# Altium project braking_io.PrjPcb (part 5 of 5)

## Sheet mcu.SchDoc: Microcontroller
size A4; Organization: Badgerloop Electrical; Address1: 133 Engineering Research Building; Address2: 1500 Engineering Drive; Address3: Madison, Wi 53706
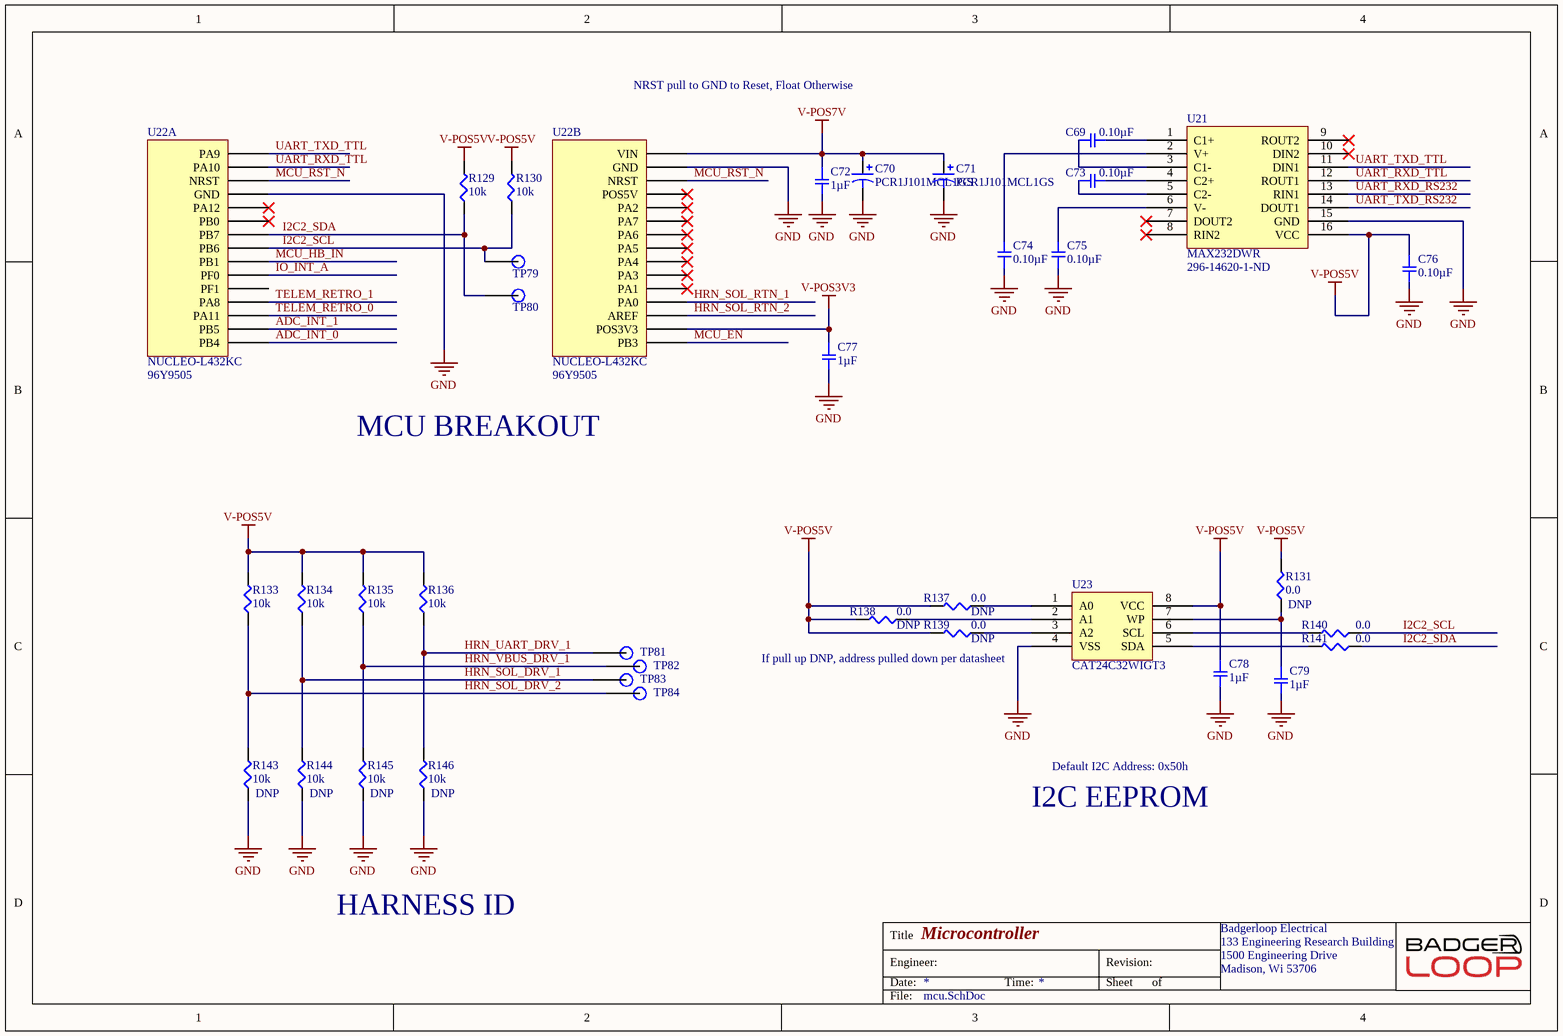
[diagram p12: mcu.SchDoc]

### Parts
C69  0.10µF  [SMD-0805C]
C70  PCR1J101MCL1GS  [CAPAE110103X126M]
C71  PCR1J101MCL1GS  [CAPAE110103X126M]
C72  1µF  [SMD-0805C]
C73  0.10µF  [SMD-0805C]
C74  0.10µF  [SMD-0805C]
C75  0.10µF  [SMD-0805C]
C76  0.10µF  [SMD-0805C]
C77  1µF  [SMD-0805C]
C78  1µF  [SMD-0805C]
C79  1µF  [SMD-0805C]
R129  10k  [SMD-0805-RES]
R130  10k  [SMD-0805-RES]
R131  0.0  [SMD-0805-RES]
R133  10k  [SMD-0805-RES]
R134  10k  [SMD-0805-RES]
R135  10k  [SMD-0805-RES]
R136  10k  [SMD-0805-RES]
R137  0.0  [SMD-0805-RES]
R138  0.0  [SMD-0805-RES]
R139  0.0  [SMD-0805-RES]
R140  0.0  [SMD-0805-RES]
R141  0.0  [SMD-0805-RES]
R143  10k  [SMD-0805-RES]
R144  10k  [SMD-0805-RES]
R145  10k  [SMD-0805-RES]
R146  10k  [SMD-0805-RES]
TP79  TP  [Test Point]  (value not drawn)
TP80  TP  [Test Point]  (value not drawn)
TP81  TP  [Test Point]  (value not drawn)
TP82  TP  [Test Point]  (value not drawn)
TP83  TP  [Test Point]  (value not drawn)
TP84  TP  [Test Point]  (value not drawn)
U21  MAX232DWR  Supplier Part Number 1: 296-14620-1-ND  [SOP127P1060X175-16N]
U22  NUCLEO-L432KC  Supplier Part Number 2: 96Y9505  [NUCLEO-L432KC]  (parts A,B of 2)
U23  CAT24C32WIGT3  [SOP127P600X175-8N]

### Nets
GND: C70.2 C71.2 C72.2 C74.1 C75.1 C76.2 C77.2 C78.2 C79.2 R143.1 R144.1 R145.1 R146.1 U21.15(GND) U22.3.4(GND) U22.4.2(GND) U23.4(VSS)
V-POS3V3: C77.1 U22.4.14(POS3V3)
V-POS5V: C76.1 C78.1 R129.2 R130.2 R131.2 R133.2 R134.2 R135.2 R136.2 R137.2 R138.2 R139.2 U21.16(VCC) U23.8(VCC)
V-POS7V: C70.1 C71.1 C72.1 U22.4.1(VIN)
ADC_INT_0: U22.3.15(PB4)
ADC_INT_1: U22.3.14(PB5)
HRN_SOL_DRV_1: R134.1 R144.2 TP83.1
HRN_SOL_DRV_2: R133.1 R143.2 TP84.1
HRN_SOL_RTN_1: U22.4.12(PA0)
HRN_SOL_RTN_2: U22.4.13(AREF)
HRN_UART_DRV_1: R136.1 R146.2 TP81.1
HRN_VBUS_DRV_1: R135.1 R145.2 TP82.1
I2C2_SCL: R130.1 R140.1 TP79.1 U22.3.8(PB6)
I2C2_SDA: R129.1 R141.1 TP80.1 U22.3.7(PB7)
IO_INT_A: U22.3.10(PF0)
MCU_EN: U22.4.15(PB3)
MCU_HB_IN: U22.3.9(PB1)
MCU_RST_N: U22.3.3(NRST) U22.4.3(NRST)
TELEM_RETRO_0: U22.3.13(PA11)
TELEM_RETRO_1: U22.3.12(PA8)
UART_RXD_RS232: U21.13(RIN1)
UART_RXD_TTL: U21.12(ROUT1) U22.3.2(PA10)
UART_TXD_RS232: U21.14(DOUT1)
UART_TXD_TTL: U21.11(DIN1) U22.3.1(PA9)
NetC69_1: C69.1 U21.3(C1-)
NetC69_2: C69.2 U21.1(C1+)
NetC73_1: C73.1 U21.5(C2-)
NetC73_2: C73.2 U21.4(C2+)
NetC74_2: C74.2 U21.2(V+)
NetC75_2: C75.2 U21.6(V-)
NetC79_1: C79.1 R131.1 U23.7(WP)
NetR137_1: R137.1 U23.1(A0)
NetR138_1: R138.1 U23.2(A1)
NetR139_1: R139.1 U23.3(A2)
NetR140_2: R140.2 U23.6(SCL)
NetR141_2: R141.2 U23.5(SDA)

Not connected (* = marked no-connect by the designer): U21 7(DOUT2)* 8(RIN2)* 9(ROUT2)* 10(DIN2)*; U22 3.5(PA12)* 3.6(PB0)* 3.11(PF1) 4.4(POS5V)* 4.5(PA2)* 4.6(PA7)* 4.7(PA6)* 4.8(PA5)* 4.9(PA4)* 4.10(PA3)* 4.11(PA1)*

### Notes on the sheet
- NRST pull to GND to Reset, Float Otherwise
- MCU BREAKOUT
- If pull up DNP, address pulled down per datasheet
- Default I2C Address: 0x50h
- I2C EEPROM
- HARNESS ID
- Title
- Engineer:
- Date:
- Time:
- Revision:
- Sheet
- of
- File:

### Library data of the parts
C69 C73-C75 = GRM219R71C104JA01D: CAP CER 0.1UF 16V X7R 0805; Manufacturer: Murata Electronics North America; Factory Stock: 0; Unit Price (USD): 0.12; Minimum Quantity: 1; Tolerance: ±5%; Datasheets: -; Image: //media.digikey.com/Renders/Murata%20Renders/0805%20(2012%20Metric)%20.85mm.jpg; Digi-Key Part Number: 490-12557-1-ND; Part Number: GRM219R71C104JA01D; Quantity Available: 6635; @ qty: 0; Packaging: Cut Tape (CT); Series: GRM; Part Status: Active; Value: 0.10µF; Voltage: 16V; Temperature Coefficient: X7R; Operating Temperature: -55°C ~ 125°C; Features: -; Ratings: -; Applications: General Purpose; Mounting Type: Surface Mount, MLCC; Package / Case: 0805 (2012 Metric); Size / Dimension: 0.079" L x 0.049" W (2.00mm x 1.25mm); Height - Seated (Max): -; Thickness (Max): 0.037" (0.95mm); Lead Spacing: -; Lead Style: -
C70 C71 = PCR1J101MCL1GS: CAP ALUM POLY 100UF 20% 63V SMD; Manufacturer: Nichicon; ESR (Equivalent Series Resistance): 24mR; Ripple Current: 3A; Leakage Current: 3uA; Life (Hours): 4000Hour; Dissipation Factor: 0.08%; Supplier 1: Digi-Key; Manufacturer Part Number: PCR1J101MCL1GS; Stock 1: 11476; Pricing 1: 1=3.63000, 10=2.92800, 100=2.28380 (USD); RoHS: Yes; Mount: Surface Mount,PCB; Case/Package: Radial; Weight: 0.045856oz; Min Operating Temperature: -55°C; Max Operating Temperature: 125°C; Capacitance: 100uF; Tolerance: 20%; Voltage Rating (DC): 63V; Package Quantity: 1; Packaging: Tape and Reel; Voltage Rating: 63V; Termination: SMD/SMT; Voltage: 63V; Diameter: 10mm; Length: 12.7mm; Height: 12.7mm; Height - Seated (Max): 0.504inch; Depth: 10.3mm; Lead Pitch: 4.6mm; Lead Free: Lead Free; ComponentLink1URL: https://datasheet.ciiva.com/29551/e-ch-ta-29551389.pdf?src-supplier=Digi-Key; ComponentLink1Description: https://datasheet.ciiva.com/29551/e-ch-ta-29551389.pdf?src-supplier=Digi-Key; ComponentLink2URL: https://datasheet.ciiva.com/29551/e-ch-ta-29551390.pdf?src-supplier=Digi-Key; ComponentLink2Description: https://datasheet.ciiva.com/29551/e-ch-ta-29551390.pdf?src-supplier=Digi-Key; ComponentLink3URL: https://datasheet.ciiva.com/29551/e-ch-ta-29551391.pdf?src-supplier=Digi-Key; ComponentLink3Description: https://datasheet.ciiva.com/29551/e-ch-ta-29551391.pdf?src-supplier=Digi-Key; Supplier Part Number 1: 493-13783-1-ND
C72 C77-C79 = GRM21BR71H105KA12L: CAP CER 1UF 50V X7R 0805; Manufacturer: Murata Electronics North America; Factory Stock: 0; Unit Price (USD): 0.25; Minimum Quantity: 1; Tolerance: ±10%; Datasheets: http://www.murata.com/~/media/webrenewal/support/library/catalog/products/capacitor/mlcc/c02e.pdf; Image: //media.digikey.com/Renders/Murata%20Renders/0805%20(2012%20Metric)%20.85mm.jpg; Digi-Key Part Number: 490-4736-1-ND; Part Number: GRM21BR71H105KA12L; Quantity Available: 988032; @ qty: 0; Packaging: Cut Tape (CT); Series: GRM; Part Status: Active; Value: 1µF; Voltage: 50V; Temperature Coefficient: X7R; Operating Temperature: -55°C ~ 125°C; Features: -; Ratings: -; Applications: General Purpose; Mounting Type: Surface Mount, MLCC; Package / Case: 0805 (2012 Metric); Size / Dimension: 0.079" L x 0.049" W (2.00mm x 1.25mm); Height - Seated (Max): -; Thickness (Max): 0.053" (1.35mm); Lead Spacing: -; Lead Style: -
C76 = GRM219R71E104KA01D: CAP CER 0.1UF 25V X7R 0805; Manufacturer: Murata Electronics North America; Factory Stock: 0; Unit Price (USD): 0.12; Minimum Quantity: 1; Tolerance: ±10%; Datasheets: http://www.murata.com/~/media/webrenewal/support/library/catalog/products/capacitor/mlcc/c02e.pdf; Image: //media.digikey.com/Renders/Murata%20Renders/0805%20(2012%20Metric)%20.85mm.jpg; Digi-Key Part Number: 490-12754-1-ND; Part Number: GRM219R71E104KA01D; Quantity Available: 8594; @ qty: 0; Packaging: Cut Tape (CT); Series: GRM; Part Status: Active; Value: 0.10µF; Voltage: 25V; Temperature Coefficient: X7R; Operating Temperature: -55°C ~ 125°C; Features: -; Ratings: -; Applications: General Purpose; Mounting Type: Surface Mount, MLCC; Package / Case: 0805 (2012 Metric); Size / Dimension: 0.079" L x 0.049" W (2.00mm x 1.25mm); Height - Seated (Max): -; Thickness (Max): 0.037" (0.95mm); Lead Spacing: -; Lead Style: -
R129 R130 R133-R136 R143-R146 = ERJ-P06J103V: RES SMD 10K OHM 5% 1/2W 0805; Manufacturer: Panasonic Electronic Components; Factory Stock: 0; Unit Price (USD): 0.01839; @ qty: 1500; Minimum Quantity: 1; Power (Watts): 0.5W, 1/2W; Temperature Coefficient: ±200ppm/°C; Part Number: ERJ-P06J103V; Datasheets: https://industrial.panasonic.com/cdbs/www-data/pdf/RDA0000/AOA0000C243.pdf; Image: //media.digikey.com/Renders/Panasonic%20Renders/ERJ-0805%20Pkg.jpg; Digi-Key Part Number: P10KADCT-ND; Quantity Available: 413576; Packaging: Cut Tape (CT); Series: ERJ; Part Status: Active; Value: 10k; Tolerance: ±5%; Composition: Thick Film; Features: Automotive AEC-Q200, Pulse Withstanding; Operating Temperature: -55°C ~ 155°C; Package / Case: 0805 (2012 Metric); Supplier Device Package: 0805; Size / Dimension: 0.079" L x 0.049" W (2.00mm x 1.25mm); Height - Seated (Max): 0.028" (0.70mm); Number of Terminations: 2; Failure Rate: -
  R143-R146: DNP: DNP
R131 R137-R141 = ERJ-6GEY0R00V: RES SMD 0.0 OHM JUMPER 1/8W 0805; Manufacturer: Panasonic Electronic Components; Factory Stock: 0; Unit Price (USD): 0.00544; @ qty: 1500; Minimum Quantity: 1; Power (Watts): 0.125W, 1/8W; Part Number: ERJ-6GEY0R00V; Datasheets: http://industrial.panasonic.com/www-cgi/jvcr13pz.cgi?E+PZ+3+AOA0001+ERJ6GEY0R00V+7+WW; Image: //media.digikey.com/Renders/Panasonic%20Renders/ERJ-0805%20Pkg.jpg; Digi-Key Part Number: P0.0ACT-ND; Quantity Available: 1597627; Packaging: Cut Tape (CT); Series: ERJ; Part Status: Active; Value: 0.0; Tolerance: Jumper; Composition: Thick Film; Features: Automotive AEC-Q200; Temperature Coefficient: -; Operating Temperature: -55°C ~ 155°C; Package / Case: 0805 (2012 Metric); Supplier Device Package: 0805; Size / Dimension: 0.079" L x 0.049" W (2.00mm x 1.25mm); Height - Seated (Max): 0.028" (0.70mm); Number of Terminations: 2; Failure Rate: -
  R131 R137-R139: DNP: DNP
TP79-TP84 = TP: SMD TEST POINT
U21 = MAX232DWR: IC DRVR/RCVR MULTCH RS232 16SOIC; Manufacturer: Texas Instruments; Nominal Supply Current: 10mA; Data Rate: 120Kbps; Number of Drivers: 2; Operating Supply Voltage: 5V; Min Supply Voltage: 4.5V; Max Supply Voltage: 5.5V; Logic Function: Transceiver,Receiver; Number of Transceivers: 1; Simplex/Duplex: Full Duplex; Supplier 1: Digi-Key; Manufacturer Part Number: MAX232DWR; Stock 1: 5901; Pricing 1: 1=1.16, 10=1.036, 100=0.7551, 500=0.63222, 1000=0.49172 (USD); Mount: Surface Mount; Case/Package: SOIC; Number of Pins: 16; Weight: 0.014829oz; Min Operating Temperature: -40°C; Max Operating Temperature: 85°C; Packaging: Tape and Reel; Package Quantity: 2000; Number of Receivers: 2; Number of Transmitters: 2; Length: 10.28mm; Height: 2.35mm; Width: 7.52mm; Radiation Hardening: No; Lead Free: Lead Free; REACH SVHC: No SVHC; ComponentLink1URL: http://www.ti.com/lit/ds/symlink/max232.pdf?src-supplier=Digi-Key; ComponentLink1Description: http://www.ti.com/lit/ds/symlink/max232.pdf?src-supplier=Digi-Key; ComponentLink2URL: http://datasheet.iiic.cc/texas_instruments/MAX232DWR.pdf?src-supplier=IIIC; ComponentLink2Description: http://datasheet.iiic.cc/texas_instruments/MAX232DWR.pdf?src-supplier=IIIC
U22 = NUCLEO-L432KC: BOARD NUCLEO STM32F303K8T6; Manufacturer: STMicroelectronics; Evaluation Kit: Yes; Number of Bits: 32; Core Architecture: ARM; Supplier 1: Digi-Key; Stock 1: 171; Pricing 1: 1=10.99000 (USD); RoHS: Yes; REACH SVHC: No SVHC; Lead Free: Lead Free; ComponentLink1URL: http://www.farnell.com/datasheets/2064195.pdf?src-supplier=Farnell; ComponentLink1Description: http://www.farnell.com/datasheets/2064195.pdf?src-supplier=Farnell; ComponentLink2URL: http://www.st.com/content/ccc/resource/technical/document/data_brief/b1/d8/13/d4/b0/b7/4b/6e/DM00214578.pdf/files/DM00214578.pdf/jcr:content/translations/en.DM00214578.pdf?src-supplier=Digi-Key; ComponentLink2Description: http://www.st.com/content/ccc/resource/technical/document/data_brief/b1/d8/13/d4/b0/b7/4b/6e/DM00214578.pdf/files/DM00214578.pdf/jcr:content/translations/en.DM00214578.pdf?src-supplier=Digi-Key; ComponentLink3URL: http://www.farnell.com/datasheets/1966773.pdf?src-supplier=Element14; ComponentLink3Description: http://www.farnell.com/datasheets/1966773.pdf?src-supplier=Element14; ComponentLink4URL: http://www.farnell.com/datasheets/2064195.pdf?src-supplier=Newark; ComponentLink4Description: http://www.farnell.com/datasheets/2064195.pdf?src-supplier=Newark; ComponentLink5URL: http://www.st.com/st-web-ui/static/active/en/resource/technical/document/user_manual/DM00116575.pdf?s_searchtype=keyword&src-supplier=Avnet+Asia; ComponentLink5Description: http://www.st.com/st-web-ui/static/active/en/resource/technical/document/user_manual/DM00116575.pdf?s_searchtype=keyword&src-supplier=Avnet+Asia; ComponentLink6URL: http://www.st.com/st-web-ui/static/active/en/resource/technical/document/user_manual/DM00116575.pdf?s_searchtype=keyword&src-supplier=Avnet; ComponentLink6Description: http://www.st.com/st-web-ui/static/active/en/resource/technical/document/user_manual/DM00116575.pdf?s_searchtype=keyword&src-supplier=Avnet; Supplier Part Number 1: 497-15981-ND; Supplier 2: Newark; Stock 2: 56; Pricing 2: 1=12.40000 (USD); ComponentLink7URL: http://www.farnell.com/datasheets/2064195.pdf?src-supplier=Element14; ComponentLink7Description: http://www.farnell.com/datasheets/2064195.pdf?src-supplier=Element14; Manufacturer Part Number: NUCLEO-L432KC
U23 = CAT24C32WIGT3: IC EEPROM 32K I2C 1MHZ 8SOIC; Manufacturer: ON Semiconductor; Interface: I2C,Serial,2-Wire; Min Supply Voltage: 1.7V; Max Supply Voltage: 5.5V; Access Time: 3500ns; Frequency: 400kHz; Nominal Supply Current: 2mA; Density: 32Kb; Number of Words: 4096; Operating Supply Voltage: 5V; Max Frequency: 100kHz; Supplier 1: Newark; Manufacturer Part Number: CAT24C32WIGT3; Stock 1: 0; RoHS: Yes; Mount: Surface Mount; Case/Package: SOIC; Number of Pins: 8; Contact Plating: Gold; Min Operating Temperature: -40°C; Max Operating Temperature: 85°C; Package Quantity: 1; Packaging: Tape and Reel; Memory Type: EEPROM; Memory Size: 32Kb; Length: 5mm; Height: 1.5mm; Width: 4mm; Radiation Hardening: No; REACH SVHC: No SVHC; Lead Free: Lead Free; Halogen Free: Halogen Free; ComponentLink1URL: https://datasheet.ciiva.com/15123/getdatasheetpartid-144155-15123242.pdf?src-supplier=Verical; ComponentLink1Description: https://datasheet.ciiva.com/15123/getdatasheetpartid-144155-15123242.pdf?src-supplier=Verical; ComponentLink2URL: https://datasheet.ciiva.com/26870/cat24c32wi-gt3-26870507.pdf?src-supplier=IIIC; ComponentLink2Description: https://datasheet.ciiva.com/26870/cat24c32wi-gt3-26870507.pdf?src-supplier=IIIC; ComponentLink3URL: https://datasheet.ciiva.com/1904/cat24c32-d-1904849.pdf?src-supplier=Digi-Key; ComponentLink3Description: https://datasheet.ciiva.com/1904/cat24c32-d-1904849.pdf?src-supplier=Digi-Key; ComponentLink4URL: https://datasheet.ciiva.com/1904/cat24c32-d-1904850.pdf?src-supplier=Digi-Key; ComponentLink4Description: https://datasheet.ciiva.com/1904/cat24c32-d-1904850.pdf?src-supplier=Digi-Key; ComponentLink5URL: https://datasheet.ciiva.com/1904/cat24c32-d-1904851.pdf?src-supplier=Digi-Key; ComponentLink5Description: https://datasheet.ciiva.com/1904/cat24c32-d-1904851.pdf?src-supplier=Digi-Key; ComponentLink6URL: https://datasheet.ciiva.com/16393/cat24c32-d-16393221.pdf?src-supplier=Future+Electronics; ComponentLink6Description: https://datasheet.ciiva.com/16393/cat24c32-d-16393221.pdf?src-supplier=Future+Electronics; ComponentLink7URL: https://datasheet.ciiva.com/16471/cat24c32-d-16471335.pdf?src-supplier=Avnet+Asia; ComponentLink7Description: https://datasheet.ciiva.com/16471/cat24c32-d-16471335.pdf?src-supplier=Avnet+Asia; ComponentLink8URL: https://datasheet.ciiva.com/3185/cat24c32-d-3185118.pdf?src-supplier=Avnet; ComponentLink8Description: https://datasheet.ciiva.com/3185/cat24c32-d-3185118.pdf?src-supplier=Avnet; ComponentLink9URL: https://datasheet.ciiva.com/22618/1696760-22618478.pdf?src-supplier=Element14; ComponentLink9Description: https://datasheet.ciiva.com/22618/1696760-22618478.pdf?src-supplier=Element14; ComponentLink10URL: https://datasheet.ciiva.com/26216/cat24c32-d-26216670.pdf?src-supplier=Avnet+Europe; ComponentLink10Description: https://datasheet.ciiva.com/26216/cat24c32-d-26216670.pdf?src-supplier=Avnet+Europe; Supplier Part Number 1: 06R0561

## Nets that join several sheets
GND: connectors (34 pins), bus_filter (11 pins), power_7V (25 pins), power_5V (22 pins), power_24V (15 pins), solenoid (37 pins), solenoid_drv (18 pins), pressure (29 pins), telemetry_adc (20 pins), watchdog (C67.2 C68.2 U20.10), retro (U13.4 U27.4), mcu (17 pins)
V-BUS: connectors (6 pins), bus_filter (F1.1 TP9.1)
V-BUS_FILT: connectors (P3.1 P15.7 P15.8), bus_filter (5 pins), power_7V (7 pins), power_5V (6 pins), power_24V (6 pins), retro (R162.1 R165.1)
V-BUS_SOL: bus_filter (F2.2 TP12.1), solenoid (12 pins), solenoid_drv (C39.1 C40.1 U14.2 U15.2)
V-POS3V3: connectors (P6.1), mcu (C77.1 U22.4.14)
V-POS5V: connectors (P2.1 P5.1 P10.1 P10.2), bus_filter (5 pins), power_7V (5 pins), power_5V (10 pins), solenoid (12 pins), solenoid_drv (10 pins), pressure (10 pins), telemetry_adc (24 pins), watchdog (6 pins), retro (LED.1 LED11.1 R163.2 R166.2), mcu (14 pins)
V-POS7V: connectors (P4.1), power_7V (5 pins), mcu (C70.1 C71.1 C72.1 U22.4.1)
V-POS24V: power_24V (5 pins), pressure (8 pins)
ADC_INT_0: telemetry_adc (R107.1 U17.6), mcu (U22.3.15)
ADC_INT_1: telemetry_adc (R116.1 U19.6), mcu (U22.3.14)
HRN_SOL_DRV_1: connectors (P8.5), mcu (R134.1 R144.2 TP83.1)
HRN_SOL_DRV_2: connectors (P9.5), mcu (R133.1 R143.2 TP84.1)
HRN_SOL_RTN_1: connectors (P8.10), mcu (U22.4.12)
HRN_SOL_RTN_2: connectors (P9.4), mcu (U22.4.13)
HRN_UART_DRV_1: connectors (P2.8), mcu (R136.1 R146.2 TP81.1)
HRN_VBUS_DRV_1: connectors (P1.5), mcu (R135.1 R145.2 TP82.1)
I2C2_SCL: solenoid_drv (R47.1), telemetry_adc (R113.2 R122.2), mcu (R130.1 R140.1 TP79.1 U22.3.8)
I2C2_SDA: solenoid_drv (R48.1), telemetry_adc (R112.2 R121.2), mcu (R129.1 R141.1 TP80.1 U22.3.7)
IO_INT_A: solenoid_drv (U12.20), mcu (U22.3.10)
IO_RST_N: solenoid_drv (R43.1 R49.2 U12.18), watchdog (TP70.1 U20.19)
MAIN_HB_IN: connectors (P2.4), watchdog (R127.1)
MCU_EN: watchdog (TP71.1 U20.3), mcu (U22.4.15)
MCU_HB_IN: watchdog (R125.1), mcu (U22.3.9)
MCU_RST_N: watchdog (TP72.1 U20.18), mcu (U22.3.3 U22.4.3)
PS_EXC_0: connectors (P7.1), pressure (R61.1 R62.1 R101.2 TP46.1)
PS_EXC_1: connectors (P7.2), pressure (R63.1 R64.1 TP47.1)
PS_EXC_2: connectors (P7.3), pressure (R65.1 R66.1 TP48.1)
PS_EXC_3: connectors (P7.4), pressure (R67.1 R68.1 TP49.1)
PS_EXC_4: connectors (P7.5), pressure (R81.1 R82.1 TP54.1)
PS_EXC_5: connectors (P7.6), pressure (R83.1 R84.1 TP55.1)
PS_EXC_6: connectors (P7.7), pressure (R85.1 R86.1 TP56.1)
PS_EXC_7: connectors (P7.8), pressure (R87.1 R88.1 TP57.1)
PS_RTN_0: connectors (P7.13), pressure (D10.2 R69.2 R102.2)
PS_RTN_1: connectors (P7.14), pressure (D11.2 R70.2)
PS_RTN_2: connectors (P7.15), pressure (D12.2 R71.2)
PS_RTN_3: connectors (P7.16), pressure (D13.2 R72.2)
PS_RTN_4: connectors (P7.17), pressure (D14.2 R89.2)
PS_RTN_5: connectors (P7.18), pressure (D15.2 R90.2)
PS_RTN_6: connectors (P7.19), pressure (D16.2 R91.2)
PS_RTN_7: connectors (P7.20), pressure (D17.2 R92.2)
RETRO_SIG0: connectors (P15.6), retro (U13.2)
RETRO_SIG1: connectors (P15.5), retro (U27.2)
SOL_DRV_0: connectors (P8.6), solenoid (C21.2 P11.1 TP28.1 U6.3)
SOL_DRV_1: connectors (P8.8), solenoid (C27.2 TP34.1 U8.3)
SOL_DRV_2: connectors (P9.10), solenoid (C33.2 TP40.1 U10.3)
SOL_DRV_3: connectors (P8.7), solenoid (C22.2 TP29.1 U7.3)
SOL_DRV_4: connectors (P8.9), solenoid (C28.2 TP35.1 U9.3)
SOL_DRV_5: connectors (P9.9), solenoid (C34.2 TP41.1 U11.3)
SOL_DRV_6: connectors (P9.8), solenoid_drv (C41.2 U14.3)
SOL_DRV_7: connectors (P9.7), solenoid_drv (C42.2 U15.3)
SOL_EN_0: solenoid (5 pins), solenoid_drv (U12.1)
SOL_EN_1: solenoid (5 pins), solenoid_drv (U12.2)
SOL_EN_2: solenoid (5 pins), solenoid_drv (U12.3)
SOL_EN_3: solenoid (5 pins), solenoid_drv (U12.4)
SOL_EN_4: solenoid (5 pins), solenoid_drv (U12.5)
SOL_EN_5: solenoid (5 pins), solenoid_drv (U12.6)
SOL_FLT_0: solenoid (R19.2 U6.5), solenoid_drv (U12.28)
SOL_FLT_1: solenoid (R27.2 U8.5), solenoid_drv (U12.27)
SOL_FLT_2: solenoid (R35.2 U10.5), solenoid_drv (U12.26)
SOL_FLT_3: solenoid (R20.2 U7.5), solenoid_drv (U12.25)
SOL_FLT_4: solenoid (R28.2 U9.5), solenoid_drv (U12.24)
SOL_FLT_5: solenoid (R36.2 U11.5), solenoid_drv (U12.23)
TELEM_I_5V: power_5V (C15.1 R13.2 TP21.1), telemetry_adc (U19.13)
TELEM_I_7V: power_7V (C92.1 R152.2 TP91.1), telemetry_adc (U19.11)
TELEM_I_BUSV: bus_filter (TP13.1 U1.5), telemetry_adc (U19.15)
TELEM_PS_0: pressure (C45.1 R73.2 TP50.1), telemetry_adc (U17.16)
TELEM_PS_1: pressure (C46.1 R74.2 TP51.1), telemetry_adc (U17.15)
TELEM_PS_2: pressure (C47.1 R75.2 TP52.1), telemetry_adc (U17.14)
TELEM_PS_3: pressure (C48.1 R76.2 TP53.1), telemetry_adc (U17.13)
TELEM_PS_4: pressure (C49.1 R93.2), telemetry_adc (U17.12)
TELEM_PS_5: pressure (C50.1 R94.2), telemetry_adc (U17.11)
TELEM_PS_6: pressure (C51.1 R95.2 TP60.1), telemetry_adc (U17.10)
TELEM_PS_7: pressure (C52.1 R96.2 TP61.1), telemetry_adc (U17.9)
TELEM_RETRO_0: retro (R163.1 R164.1 U13.3), mcu (U22.3.13)
TELEM_RETRO_1: retro (R166.1 R167.1 U27.3), mcu (U22.3.12)
TELEM_THERM_0: pressure (C53.1 R105.2 TP63.1), telemetry_adc (U19.10)
TELEM_THERM_1: pressure (C54.1 R106.2 TP65.1), telemetry_adc (U19.9)
TELEM_V_5V: power_5V (C18.1 R16.2 TP22.1), telemetry_adc (U19.14)
TELEM_V_7V: power_7V (C94.1 R155.2 TP92.1), telemetry_adc (U19.12)
TELEM_V_BUSV: bus_filter (C3.1 R5.2 TP14.1), telemetry_adc (U19.16)
THERM_OUT_0: connectors (P10.3), pressure (R103.1 R105.1 TH1.2 TP62.1)
THERM_OUT_1: connectors (P10.4), pressure (R104.1 R106.1 TH2.2 TP64.1)
UART_RXD_RS232: connectors (P2.3), mcu (U21.13)
UART_TXD_RS232: connectors (P2.2), mcu (U21.14)